# Altium schematic sheet [08] - CONNECTORS.SchDoc
size A4; DocumentNumber: 8; SheetNumber: 8; SheetTotal: 9
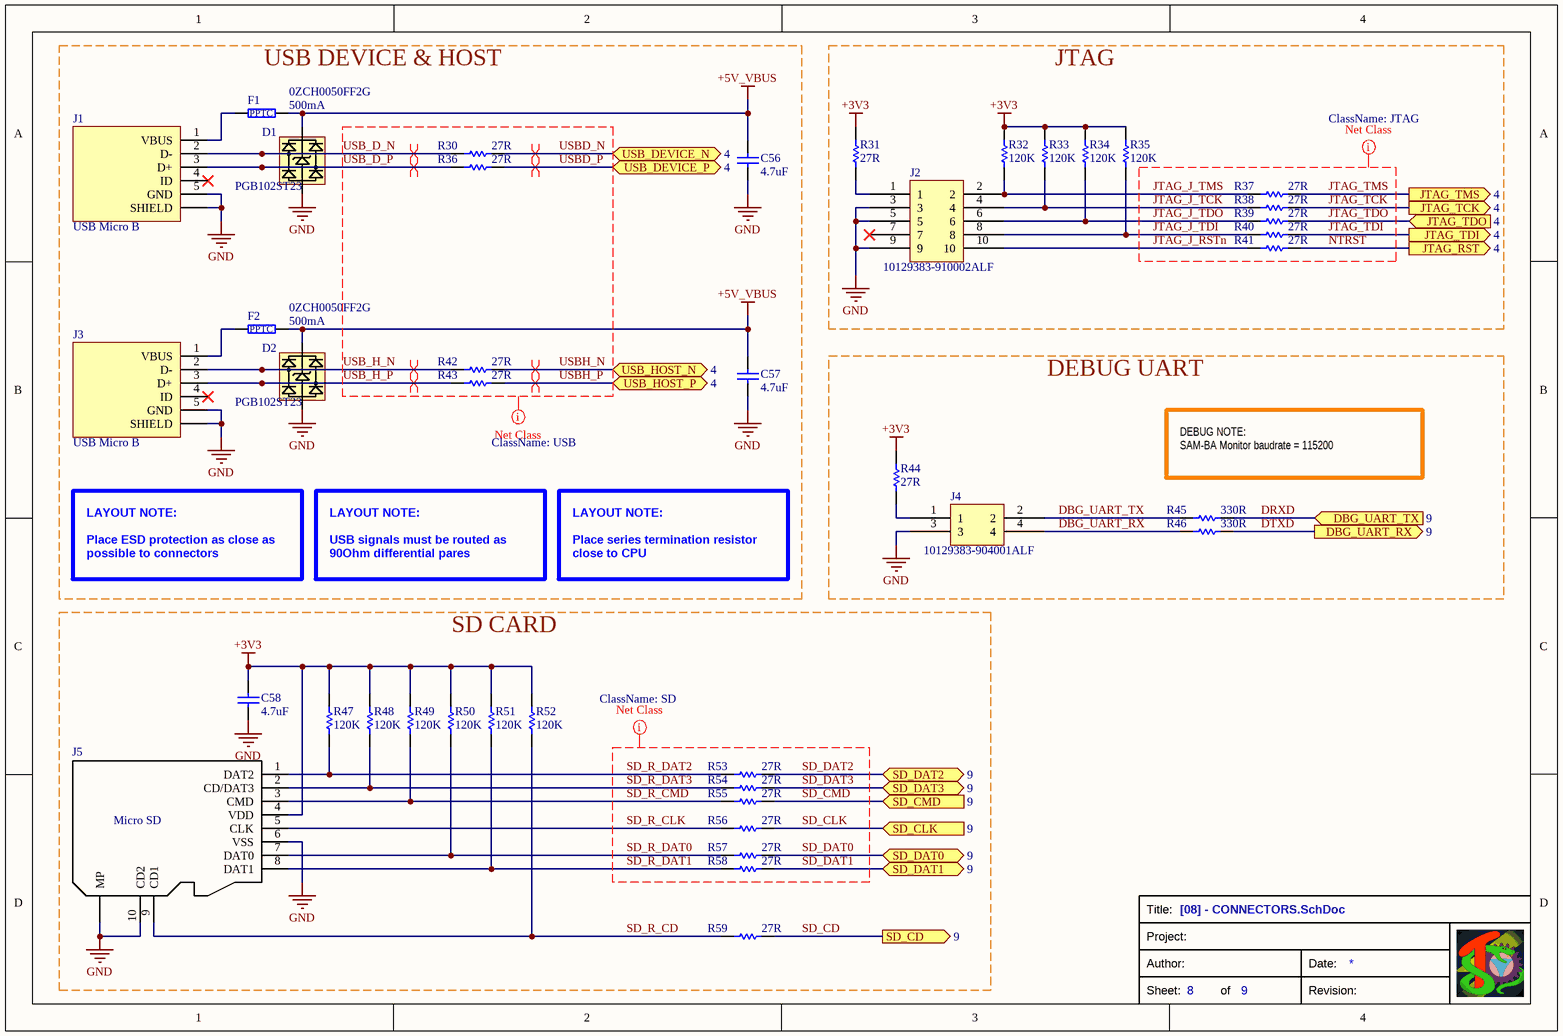
[diagram p0: [08] - CONNECTORS.SchDoc]

## Parts
C56  value 4.7uF  [CAP-0805]  (hidden comment: 885012107013)
C57  value 4.7uF  [CAP-0805]  (hidden comment: 885012107013)
C58  value 4.7uF  [CAP-0805]  (hidden comment: 885012107013)
D1  PGB102ST23  [SOT23-5]
D2  PGB102ST23  [SOT23-5]
F1  0ZCH0050FF2G  value 500mA  [FUS-0ZCH-3x2.35]
F2  0ZCH0050FF2G  value 500mA  [FUS-0ZCH-3x2.35]
J1  USB Micro B  [UJ2-MIBH-G-SMT-TR]
J2  10129383-910002ALF  [HEADER-5X2-2.54-SMD- 10129383]
J3  USB Micro B  [UJ2-MIBH-G-SMT-TR]
J4  10129383-904001ALF  [HEADER-2X2-2.54-SMD- 10129383]
J5  Micro SD  [104031-0811]
R30  value 27R  [RES-0603]  (hidden comment: RT0603DRD0727RL)
R31  value 27R  [RES-0603]  (hidden comment: RT0603DRD0727RL)
R32  value 120K  [RES-0603]  (hidden comment: RT0603FRE07120KL)
R33  value 120K  [RES-0603]  (hidden comment: RT0603FRE07120KL)
R34  value 120K  [RES-0603]  (hidden comment: RT0603FRE07120KL)
R35  value 120K  [RES-0603]  (hidden comment: RT0603FRE07120KL)
R36  value 27R  [RES-0603]  (hidden comment: RT0603DRD0727RL)
R37  value 27R  [RES-0603]  (hidden comment: RT0603DRD0727RL)
R38  value 27R  [RES-0603]  (hidden comment: RT0603DRD0727RL)
R39  value 27R  [RES-0603]  (hidden comment: RT0603DRD0727RL)
R40  value 27R  [RES-0603]  (hidden comment: RT0603DRD0727RL)
R41  value 27R  [RES-0603]  (hidden comment: RT0603DRD0727RL)
R42  value 27R  [RES-0603]  (hidden comment: RT0603DRD0727RL)
R43  value 27R  [RES-0603]  (hidden comment: RT0603DRD0727RL)
R44  value 27R  [RES-0603]  (hidden comment: RT0603DRD0727RL)
R45  value 330R  [RES-0603]  (hidden comment: RT0603FRD07330RL)
R46  value 330R  [RES-0603]  (hidden comment: RT0603FRD07330RL)
R47  value 120K  [RES-0603]  (hidden comment: RT0603FRE07120KL)
R48  value 120K  [RES-0603]  (hidden comment: RT0603FRE07120KL)
R49  value 120K  [RES-0603]  (hidden comment: RT0603FRE07120KL)
R50  value 120K  [RES-0603]  (hidden comment: RT0603FRE07120KL)
R51  value 120K  [RES-0603]  (hidden comment: RT0603FRE07120KL)
R52  value 120K  [RES-0603]  (hidden comment: RT0603FRE07120KL)
R53  value 27R  [RES-0603]  (hidden comment: RT0603DRD0727RL)
R54  value 27R  [RES-0603]  (hidden comment: RT0603DRD0727RL)
R55  value 27R  [RES-0603]  (hidden comment: RT0603DRD0727RL)
R56  value 27R  [RES-0603]  (hidden comment: RT0603DRD0727RL)
R57  value 27R  [RES-0603]  (hidden comment: RT0603DRD0727RL)
R58  value 27R  [RES-0603]  (hidden comment: RT0603DRD0727RL)
R59  value 27R  [RES-0603]  (hidden comment: RT0603DRD0727RL)

## Blocks framed on the sheet
USB DEVICE & HOST: C56 C57 D1 D2 F1 F2 J1 J3 R30 R36 R42 R43
JTAG: J2 R31-R35 R37-R41
DEBUG UART: J4 R44-R46
SD CARD: C58 J5 R47-R59

## Ports
DBG_UART_RX (out, see 9), DBG_UART_TX (in, see 9), JTAG_RST (out, see 4), JTAG_TCK (out, see 4), JTAG_TDI (out, see 4), JTAG_TDO (in, see 4), JTAG_TMS (out, see 4), SD_CD (out, see 9), SD_CLK (in, see 9), SD_CMD (in, see 9), SD_DAT0 (bidir, see 9), SD_DAT1 (bidir, see 9), SD_DAT2 (bidir, see 9), SD_DAT3 (bidir, see 9), USB_DEVICE_N (bidir, see 4), USB_DEVICE_P (bidir, see 4), USB_HOST_N (bidir, see 4), USB_HOST_P (bidir, see 4)

## Nets
+3V3: C58.2 J5.4(VDD) R31.2 R32.2 R33.2 R34.2 R35.2 R44.2 R47.2 R48.2 R49.2 R50.2 R51.2 R52.2
+5V_VBUS: C56.2 C57.2 D1.5(Vp) D2.5(Vp) F1.2 F2.2
GND: C56.1 C57.1 C58.1 D1.2(Vn) D2.2(Vn) J1.5(GND) J1.SH(SHIELD) J2.3 J2.5 J2.9 J3.5(GND) J3.SH(SHIELD) J4.3 J5.6(VSS) J5.10(CD2) J5.MP
DBG_UART_RX: J4.4 R46.1
DBG_UART_TX: J4.2 R45.1
DRXD: R45.2 ; port DBG_UART_TX
DTXD: R46.2 ; port DBG_UART_RX
JTAG_J_RSTn: J2.10 R41.1
JTAG_J_TCK: J2.4 R33.1 R38.1
JTAG_J_TDI: J2.8 R35.1 R40.1
JTAG_J_TDO: J2.6 R34.1 R39.1
JTAG_J_TMS: J2.2 R32.1 R37.1
JTAG_TCK: R38.2 ; port JTAG_TCK
JTAG_TDI: R40.2 ; port JTAG_TDI
JTAG_TDO: R39.2 ; port JTAG_TDO
JTAG_TMS: R37.2 ; port JTAG_TMS
NTRST: R41.2 ; port JTAG_RST
SD_CD: R59.2 ; port SD_CD
SD_CLK: R56.2 ; port SD_CLK
SD_CMD: R55.2 ; port SD_CMD
SD_DAT0: R57.2 ; port SD_DAT0
SD_DAT1: R58.2 ; port SD_DAT1
SD_DAT2: R53.2 ; port SD_DAT2
SD_DAT3: R54.2 ; port SD_DAT3
SD_R_CD: J5.9(CD1) R52.1 R59.1
SD_R_CLK: J5.5(CLK) R56.1
SD_R_CMD: J5.3(CMD) R49.1 R55.1
SD_R_DAT0: J5.7(DAT0) R50.1 R57.1
SD_R_DAT1: J5.8(DAT1) R51.1 R58.1
SD_R_DAT2: J5.1(DAT2) R47.1 R53.1
SD_R_DAT3: J5.2(CD/DAT3) R48.1 R54.1
USB_D_N: D1.3(CH1) J1.2(D-) R30.1
USB_D_P: D1.4(CH2) J1.3(D+) R36.1
USB_H_N: D2.3(CH1) J3.2(D-) R42.1
USB_H_P: D2.4(CH2) J3.3(D+) R43.1
USBD_N: R30.2 ; port USB_DEVICE_N
USBD_P: R36.2 ; port USB_DEVICE_P
USBH_N: R42.2 ; port USB_HOST_N
USBH_P: R43.2 ; port USB_HOST_P
NetF1_1: F1.1 J1.1(VBUS)
NetF2_1: F2.1 J3.1(VBUS)
NetJ2_1: J2.1 R31.1
NetJ4_1: J4.1 R44.1

Not connected (* = marked no-connect by the designer): J1 4(ID)*; J2 7*; J3 4(ID)*

## Layout directives
differential pair; differential pair class DIFF90: USB_D_N, USB_D_P, USB_H_N, USB_H_P, USBD_N, USBD_P, USBH_N, USBH_P
net class SD: SD_CLK, SD_CMD, SD_DAT0, SD_DAT1, SD_DAT2, SD_DAT3, SD_R_CLK, SD_R_CMD, SD_R_DAT0, SD_R_DAT1, SD_R_DAT2, SD_R_DAT3
net class USB: USB_D_N, USB_D_P, USB_H_N, USB_H_P, USBD_N, USBD_P, USBH_N, USBH_P
net class JTAG: JTAG_J_RSTn, JTAG_J_TCK, JTAG_J_TDI, JTAG_J_TDO, JTAG_J_TMS, JTAG_TCK, JTAG_TDI, JTAG_TDO, JTAG_TMS, NTRST

## Notes on the sheet
- DEBUG NOTE:
  SAM-BA Monitor baudrate = 115200
- LAYOUT NOTE:
  Place ESD protection as close as possible to connectors
- LAYOUT NOTE:
  USB signals must be routed as 90Ohm differential pares
- LAYOUT NOTE:
  Place series termination resistor close to CPU
- Title:
- Project:
- Sheet:
- Author:
- of
- Revision:
- Date:
- (in symbol PPTC-500mA-16V-0ZCH0050FF2G) PPTC

## Library data of the parts
C56-C58 = CAP-0805-4.7u-885012107013_2: Multilayer Ceramic Capacitors MLCC - SMD/SMT WCAP-CSGP 4.7uF 0805 20% 16V MLCC; Manufacturer: Wurth Elektronik; Voltage Rating DC: 16 VDC; Supplier 1: Mouser; Supplier Part Number 1: 710-885012107013
D1 D2 = DIODE-TVS-PGB102ST23: ESD Suppressors / TVS Diodes 2 Ch TVS Diode Array 3.3V 6.0A 400mW; Supplier 1: Mouser; Supplier Part Number 1: 621-D1213A-02SM-7
F1 F2 = PPTC-500mA-16V-0ZCH0050FF2G: Resettable Fuses - PPTC Fuse; Manufacturer: Bel; Maximum Voltage: 16V; Supplier 1: Mouser; Supplier Part Number 1: 530-0ZCH0050FF2G
J1 J3 = UJ2-MIBH-G-SMT-TR: USB Connectors Micro B, USB 2.0, 1.8 A, Right Angle, Surface Mount (SMT), USB Receptacle; Supplier 1: Mouser; Supplier Part Number 1: 490-UJ2-MIBH-G-SMTTR
J2 = HEADER-5x2-2.54-SMD-10129383-910002ALF: Headers & Wire Housings ECONOSTIK HEADER DR VT SMT 2X5; Supplier 1: Mouser; Supplier Part Number 1: 649-1012938391002ALF
J4 = HEADER-2x2-2.54-SMD-10129383-904001ALF: Headers & Wire Housings ECONOSTIK HEADER DR VT SMT 2X2; Supplier 1: Mouser; Supplier Part Number 1: 649-1012938390401ALF
J5 = 104031-0811: Memory Card Connectors MICRO SD PUSH-PULL SMT 1.42MM HEIGHT; Supplier 1: Mouser; Supplier Part Number 1: 538-104031-0811
R30 R31 R36-R44 R53-R59 = RES-0603-27R-RT0603DRD0727RL: Thin Film Resistors - SMD 1/10W 27 ohm 1% 50ppm; Manufacturer: Yageo; Supplier 1: Mouser; Supplier Part Number 1: 603-RT0603DRD0727RL
R32-R35 R47-R52 = RES-0603-120K-RT0603FRE07120KL: Thin Film Resistors - SMD 1/10W 120K ohm 1% 50ppm; Manufacturer: Yageo; Supplier 1: Mouser; Supplier Part Number 1: 603-RT0603FRE07120KL
R45 R46 = RES-0603-330R-RT0603FRD07330RL: Thin Film Resistors - SMD 1/10W 330 ohm 1% 50ppm; Manufacturer: Yageo; Supplier 1: Mouser; Supplier Part Number 1: 603-RT0603FRD07330RL